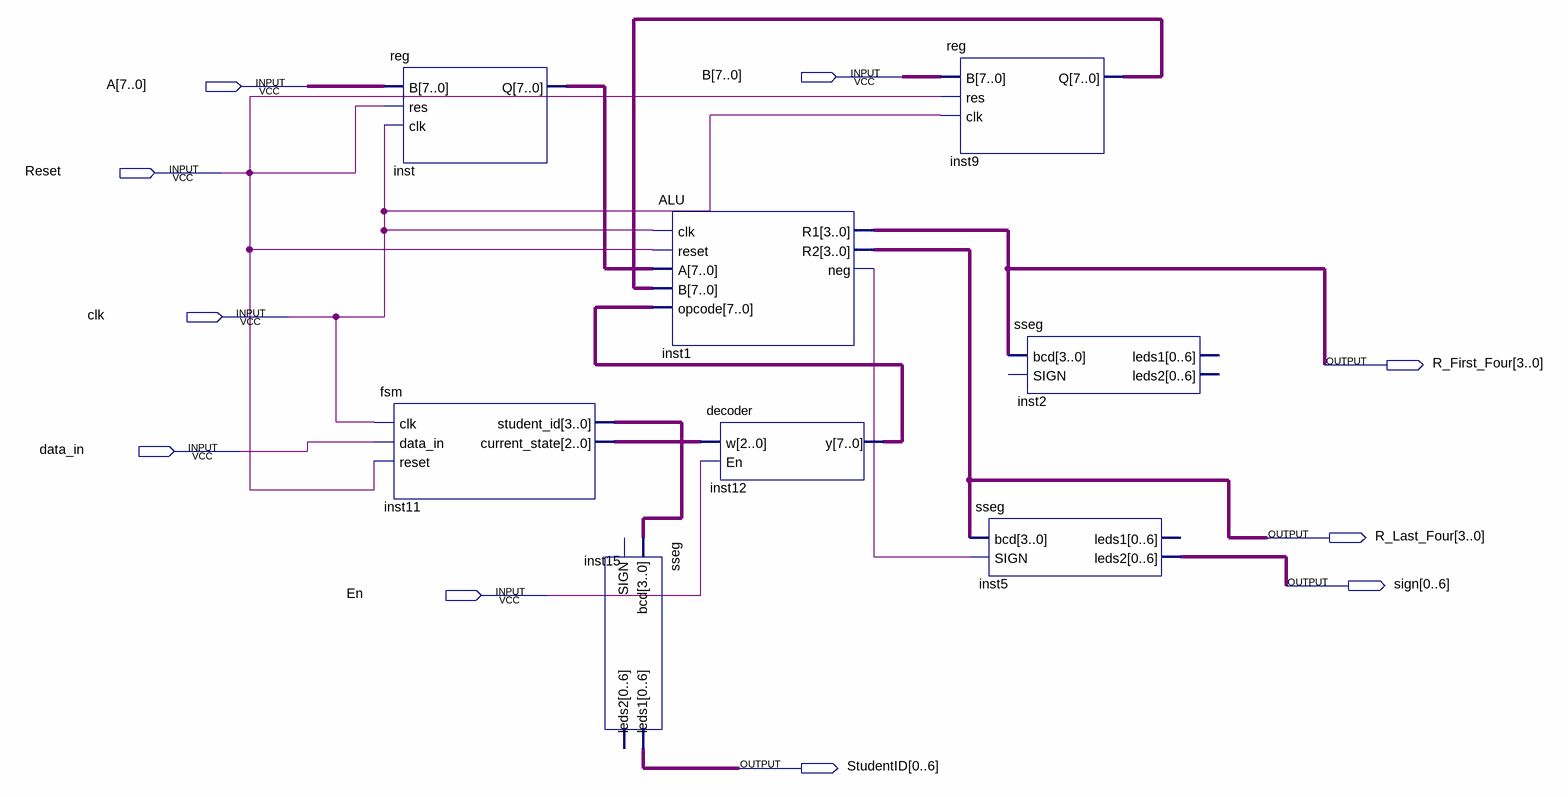
[diagram p0: schematic sheet]
// Quartus schematic block2.bdf as structural Verilog: 8 symbols, 10 pins
module block2 (
  input  [7:0] B,
  input  [7:0] A,
  input  Reset,
  input  clk,
  input  data_in,
  input  En,
  output [3:0] R_First_Four,
  output [3:0] R_Last_Four,
  output [0:6] sign,
  output [0:6] StudentID
);

  wire inst1_neg;
  wire [2:0] inst11_current_state;
  wire [3:0] inst11_student_id;
  wire [7:0] inst9_q, inst12_y, inst_q;

  \reg  inst (.B(A), .res(Reset), .clk(clk), .Q(inst_q));
  fsm inst11 (
    .clk(clk), .data_in(data_in), .reset(Reset), .student_id(inst11_student_id),
    .current_state(inst11_current_state));
  sseg inst15 (.bcd(inst11_student_id), .leds1(StudentID));  // open: SIGN, leds2
  ALU inst1 (
    .clk(clk), .reset(Reset), .A(inst_q), .B(inst9_q), .opcode(inst12_y), .R1(R_First_Four),
    .R2(R_Last_Four), .neg(inst1_neg));
  decoder inst12 (.w(inst11_current_state), .En(En), .y(inst12_y));
  \reg  inst9 (.B(B), .res(Reset), .clk(clk), .Q(inst9_q));
  sseg inst2 (.bcd(R_First_Four));  // open: SIGN, leds1, leds2
  sseg inst5 (.bcd(R_Last_Four), .SIGN(inst1_neg), .leds2(sign));  // open: leds1
endmodule
